# Altium schematic sheet EVK-NORA-W4_SCHEM_0000_Topsheet.SchDoc
size A3; Date: 04/04/2024; CompanyName: U-Blox; DrawnBy: ASOH; Engineer: ASOH; Organization: U-Blox; SheetNumber: 1; SheetTotal: 6; SheetSize: B; SheetTitle: TopSheet
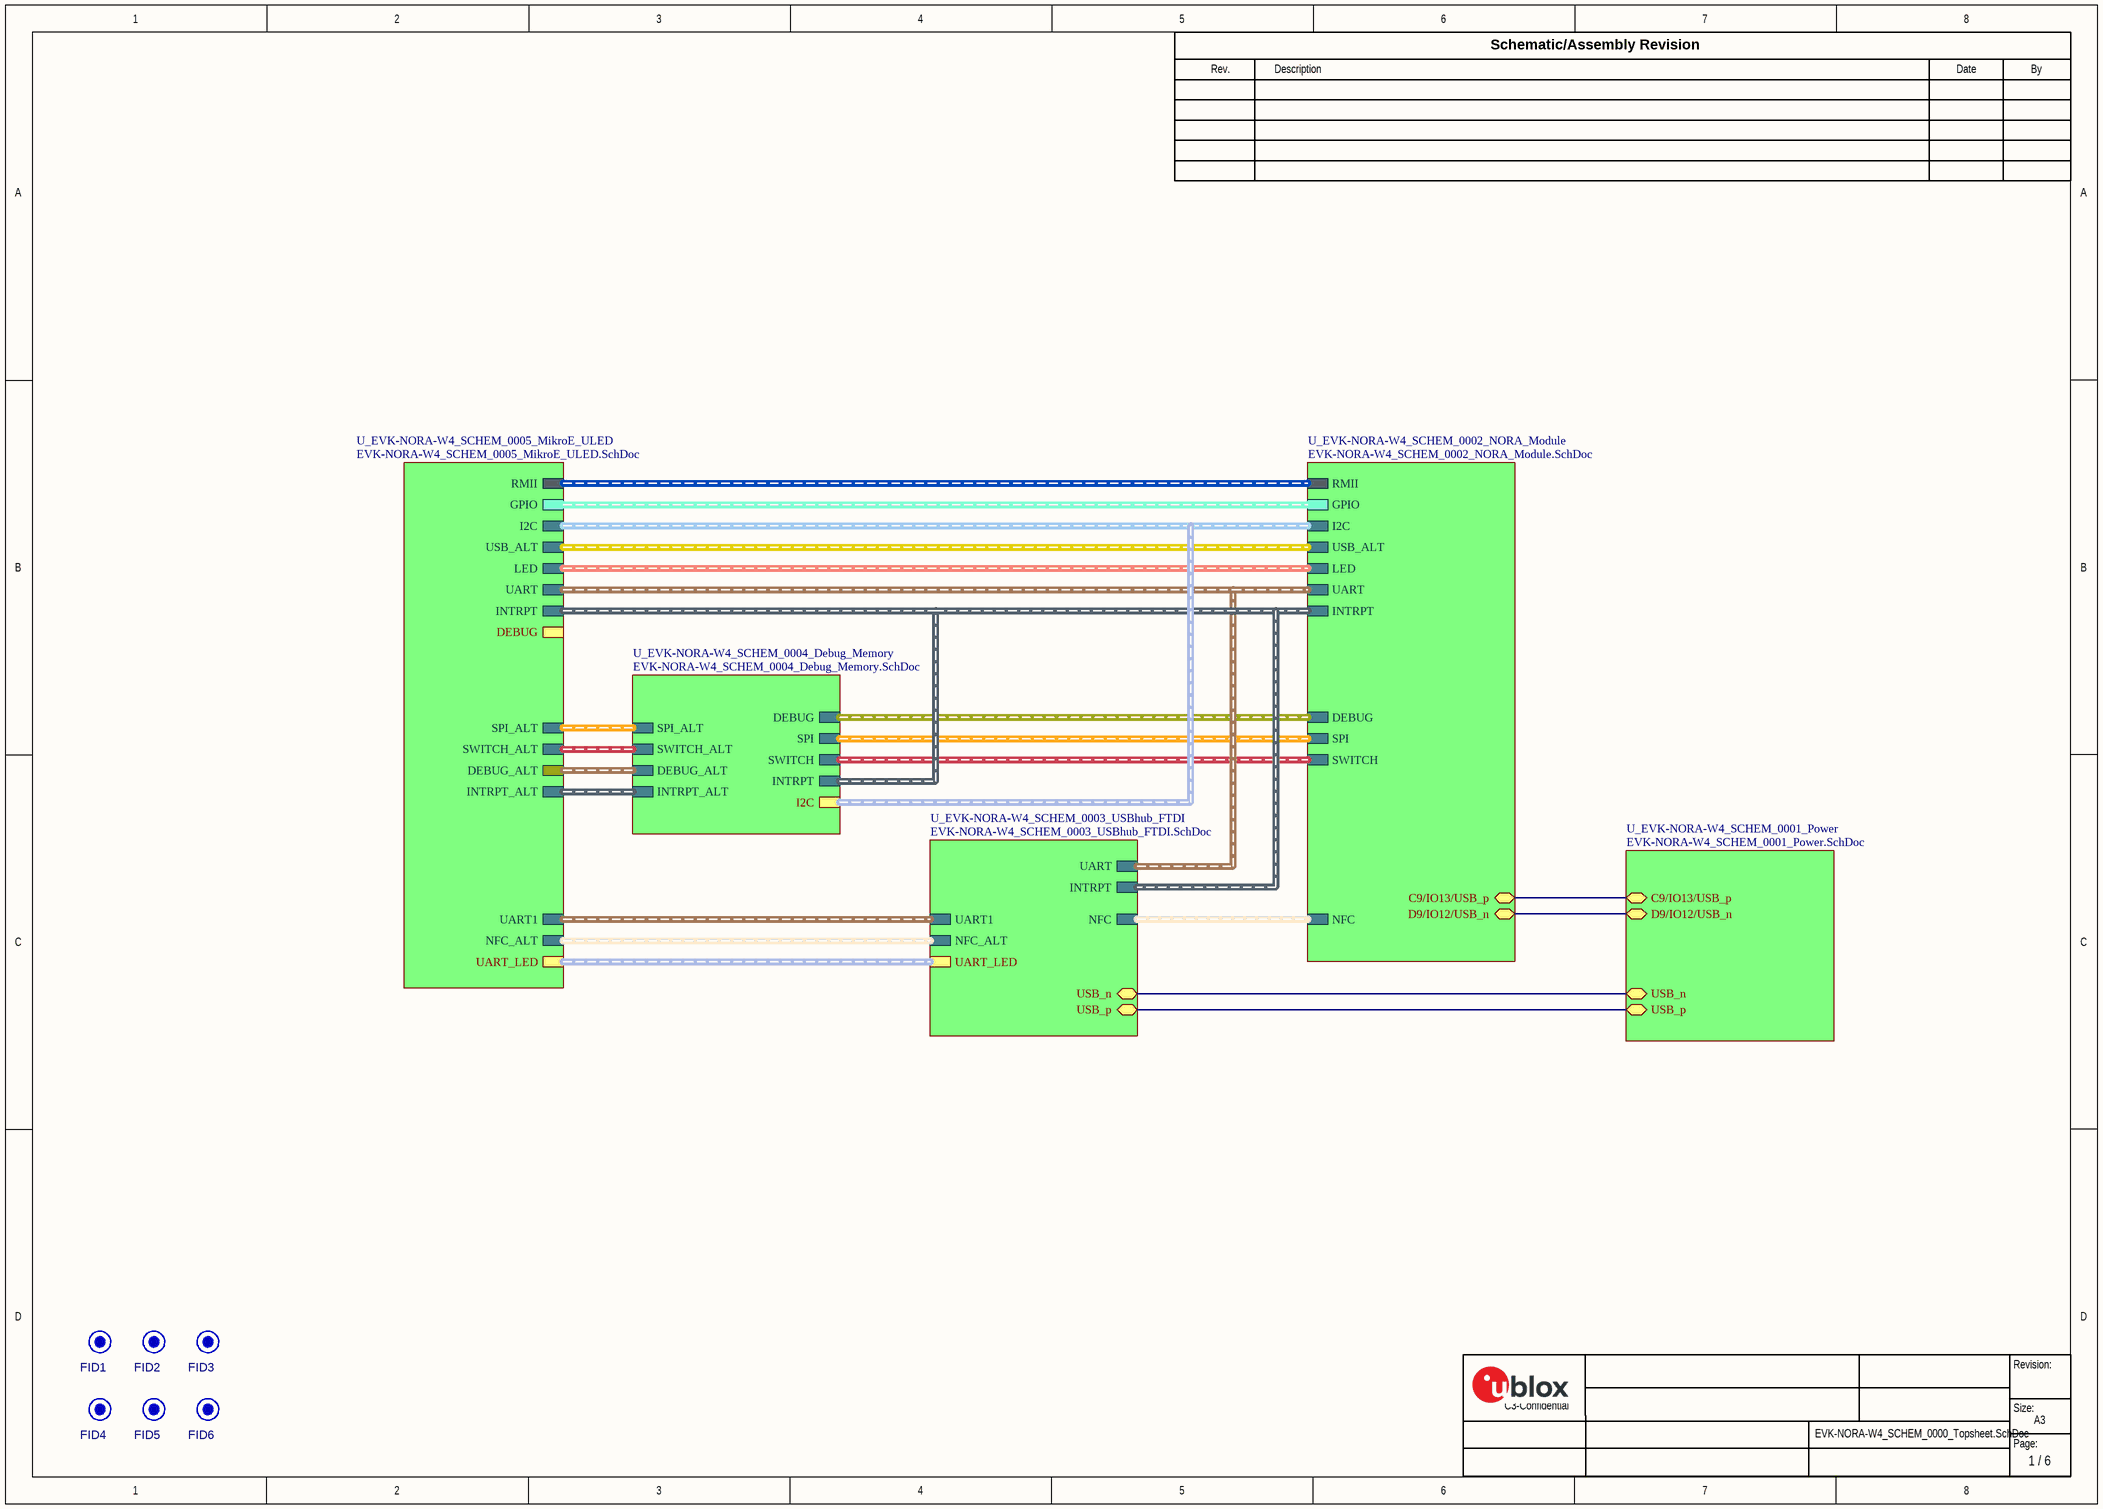
[diagram p0: EVK-NORA-W4_SCHEM_0000_Topsheet.SchDoc]

## Parts
FID1  FID  [FIDUCIAL40]  (value not drawn)  (no BOM)
FID2  FID  [FIDUCIAL40]  (value not drawn)  (no BOM)
FID3  FID  [FIDUCIAL40]  (value not drawn)  (no BOM)
FID4  FID  [FIDUCIAL40]  (value not drawn)  (no BOM)
FID5  FID  [FIDUCIAL40]  (value not drawn)  (no BOM)
FID6  FID  [FIDUCIAL40]  (value not drawn)  (no BOM)

## Sub-sheets
U_EVK-NORA-W4_SCHEM_0001_Power = EVK-NORA-W4_SCHEM_0001_Power.SchDoc: USB_n (bidir), USB_p (bidir), C9/IO13/USB_p (bidir), D9/IO12/USB_n (bidir)
U_EVK-NORA-W4_SCHEM_0002_NORA_Module = EVK-NORA-W4_SCHEM_0002_NORA_Module.SchDoc: LED (harness LED), DEBUG (harness Debug), INTRPT (harness INTRPT), UART (harness UART), SPI (harness SPI), I2C (harness I2C), NFC (harness NFC), SWITCH (harness SWITCH), RMII (harness RMII), GPIO (harness GPIO), USB_ALT (harness USB_ALT), C9/IO13/USB_p (bidir), D9/IO12/USB_n (bidir)
U_EVK-NORA-W4_SCHEM_0003_USBhub_FTDI = EVK-NORA-W4_SCHEM_0003_USBhub_FTDI.SchDoc: INTRPT (harness INTRPT), UART (harness UART), USB_n (bidir), USB_p (bidir), NFC_ALT (harness NFC_ALT), NFC (harness NFC), UART1 (harness UART1), UART_LED (harness UART_LED)
U_EVK-NORA-W4_SCHEM_0004_Debug_Memory = EVK-NORA-W4_SCHEM_0004_Debug_Memory.SchDoc: DEBUG (harness Debug), INTRPT (harness INTRPT), SPI_ALT (harness SPI_ALT), DEBUG_ALT (harness DEBUG_ALT), SWITCH_ALT (harness SWITCH_ALT), INTRPT_ALT (harness INTRPT_ALT), SPI (harness SPI), SWITCH (harness SWITCH), I2C (harness I2C)
U_EVK-NORA-W4_SCHEM_0005_MikroE_ULED = EVK-NORA-W4_SCHEM_0005_MikroE_ULED.SchDoc: INTRPT (harness INTRPT), UART (harness UART), RMII (harness RMII), INTRPT_ALT (harness INTRPT_ALT), DEBUG_ALT (harness DEBUG_ALT), USB_ALT (harness USB_ALT), SWITCH_ALT (harness SWITCH_ALT), I2C (harness I2C), UART1 (harness UART1), GPIO (harness GPIO), SPI_ALT (harness SPI_ALT), LED (harness LED), NFC_ALT (harness NFC_ALT), DEBUG (harness Debug), UART_LED (harness UART_LED)

## Nets
(unnamed): sheet U_EVK-NORA-W4_SCHEM_0001_Power/USB_n, sheet U_EVK-NORA-W4_SCHEM_0003_USBhub_FTDI/USB_n
(unnamed): sheet U_EVK-NORA-W4_SCHEM_0001_Power/USB_p, sheet U_EVK-NORA-W4_SCHEM_0003_USBhub_FTDI/USB_p
(unnamed): sheet U_EVK-NORA-W4_SCHEM_0001_Power/C9/IO13/USB_p, sheet U_EVK-NORA-W4_SCHEM_0002_NORA_Module/C9/IO13/USB_p
(unnamed): sheet U_EVK-NORA-W4_SCHEM_0001_Power/D9/IO12/USB_n, sheet U_EVK-NORA-W4_SCHEM_0002_NORA_Module/D9/IO12/USB_n

## Buses and harness runs
harness sheet U_EVK-NORA-W4_SCHEM_0002_NORA_Module/DEBUG = sheet U_EVK-NORA-W4_SCHEM_0004_Debug_Memory/DEBUG
harness sheet U_EVK-NORA-W4_SCHEM_0002_NORA_Module/GPIO = sheet U_EVK-NORA-W4_SCHEM_0005_MikroE_ULED/GPIO
harness sheet U_EVK-NORA-W4_SCHEM_0002_NORA_Module/I2C = sheet U_EVK-NORA-W4_SCHEM_0004_Debug_Memory/I2C = sheet U_EVK-NORA-W4_SCHEM_0005_MikroE_ULED/I2C
harness sheet U_EVK-NORA-W4_SCHEM_0002_NORA_Module/INTRPT = sheet U_EVK-NORA-W4_SCHEM_0003_USBhub_FTDI/INTRPT = sheet U_EVK-NORA-W4_SCHEM_0004_Debug_Memory/INTRPT = sheet U_EVK-NORA-W4_SCHEM_0005_MikroE_ULED/INTRPT
harness sheet U_EVK-NORA-W4_SCHEM_0002_NORA_Module/LED = sheet U_EVK-NORA-W4_SCHEM_0005_MikroE_ULED/LED
harness sheet U_EVK-NORA-W4_SCHEM_0002_NORA_Module/NFC = sheet U_EVK-NORA-W4_SCHEM_0003_USBhub_FTDI/NFC
harness sheet U_EVK-NORA-W4_SCHEM_0002_NORA_Module/RMII = sheet U_EVK-NORA-W4_SCHEM_0005_MikroE_ULED/RMII
harness sheet U_EVK-NORA-W4_SCHEM_0002_NORA_Module/SPI = sheet U_EVK-NORA-W4_SCHEM_0004_Debug_Memory/SPI
harness sheet U_EVK-NORA-W4_SCHEM_0002_NORA_Module/SWITCH = sheet U_EVK-NORA-W4_SCHEM_0004_Debug_Memory/SWITCH
harness sheet U_EVK-NORA-W4_SCHEM_0002_NORA_Module/UART = sheet U_EVK-NORA-W4_SCHEM_0003_USBhub_FTDI/UART = sheet U_EVK-NORA-W4_SCHEM_0005_MikroE_ULED/UART
harness sheet U_EVK-NORA-W4_SCHEM_0002_NORA_Module/USB_ALT = sheet U_EVK-NORA-W4_SCHEM_0005_MikroE_ULED/USB_ALT
harness sheet U_EVK-NORA-W4_SCHEM_0003_USBhub_FTDI/NFC_ALT = sheet U_EVK-NORA-W4_SCHEM_0005_MikroE_ULED/NFC_ALT
harness sheet U_EVK-NORA-W4_SCHEM_0003_USBhub_FTDI/UART1 = sheet U_EVK-NORA-W4_SCHEM_0005_MikroE_ULED/UART1
harness sheet U_EVK-NORA-W4_SCHEM_0003_USBhub_FTDI/UART_LED = sheet U_EVK-NORA-W4_SCHEM_0005_MikroE_ULED/UART_LED
harness sheet U_EVK-NORA-W4_SCHEM_0004_Debug_Memory/DEBUG_ALT = sheet U_EVK-NORA-W4_SCHEM_0005_MikroE_ULED/DEBUG_ALT
harness sheet U_EVK-NORA-W4_SCHEM_0004_Debug_Memory/INTRPT_ALT = sheet U_EVK-NORA-W4_SCHEM_0005_MikroE_ULED/INTRPT_ALT
harness sheet U_EVK-NORA-W4_SCHEM_0004_Debug_Memory/SPI_ALT = sheet U_EVK-NORA-W4_SCHEM_0005_MikroE_ULED/SPI_ALT
harness sheet U_EVK-NORA-W4_SCHEM_0004_Debug_Memory/SWITCH_ALT = sheet U_EVK-NORA-W4_SCHEM_0005_MikroE_ULED/SWITCH_ALT

## Notes on the sheet
- Rev.
- Description
- Schematic/Assembly Revision
- Date
- By
- Revision:
- C3-Confidential
- Page:
- Size:
- A3

## Library data of the parts
FID1-FID6 = FIDUCIAL.04: Fiducial, 0.040" inner Dia, 0.075" outer Dia; Added By: Jeremy D; Part Number: FIDUCIAL.04; Size: 0.040"; Height: 0; DNP: DNP; Added Date: 2/1/2015; Checked By: Paul B; Checked Date: 2/5/2015